# Altium schematic sheet Measurement_CS5463_simple.SchDoc
size A4
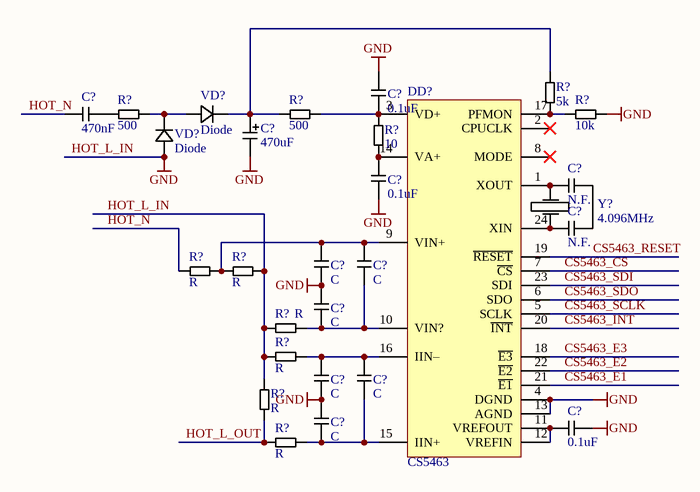
[diagram p0: Measurement_CS5463_simple.SchDoc]

## Parts
(Parts that share a designator on the sheet are numbered #1, #2 ... from top to bottom, then left to right.)
C?#1  0.1uF  [C0603]
C?#2  470nF  [C0603]
C?#3  470uF  [C_EL_6.3]
C?#4  0.1uF  [C0603]
C?#5  N.F.  [C0603]
C?#6  N.F.  [C0603]
C?#7  C  [C0603]
C?#8  C  [C0603]
C?#9  C  [C0603]
C?#10  C  [C0603]
C?#11  C  [C0603]
C?#12  C  [C0603]
C?#13  0.1uF  [C0603]
DD?  CS5463  [TSSOP-24]
R?#1  5k  [R0603]
R?#2  500  [R0603]
R?#3  500  [R0603]
R?#4  10k  [R0603]
R?#5  10  [R0603]
R?#6  R  [R0603]
R?#7  R  [R0603]
R?#8  R  [R0603]
R?#9  R  [R0603]
R?#10  R  [R0805]
R?#11  R  [R0603]
VD?#1  Diode  [SOD-123]
VD?#2  Diode  [SOD-123]
Y?  4.096MHz  [Xtal 0532]

## Nets
HOT_L_IN: C?#1.1 C?#3.2 C?#4.2 C?#7.2 C?#9.1 C?#10.2 C?#12.1 C?#13.2 DD?.4(DGND) DD?.13(AGND) R?#4.2 R?#7.2 R?#8.1 R?#9.1 R?#10.2 VD?#2.1(K)  [also labelled GND]
CS5463_CS: DD?.7(~{CS})
CS5463_E1: DD?.21(~{E1})
CS5463_E2: DD?.22(~{E2})
CS5463_E3: DD?.18(~{E3})
CS5463_INT: DD?.20(~{INT})
CS5463_RESET: DD?.19(~{RESET})
CS5463_SCLK: DD?.5(SCLK)
CS5463_SDI: DD?.23(SDI)
CS5463_SDO: DD?.6(SDO)
HOT_L_OUT: R?#10.1 R?#11.1
HOT_N: C?#2.1 R?#6.1
NetC?#1_2: C?#1.2 DD?.3(VD+) R?#3.2 R?#5.2
NetC?#2_2: C?#2.2 R?#2.1
NetC?#3_1: C?#3.1 R?#1.2 R?#3.1 VD?#1.2(A)
NetC?#4_1: C?#4.1 DD?.14(VA+) R?#5.1
NetC?#5_1: C?#5.1 DD?.1(XOUT) Y?.4(GND)
NetC?#5_2: C?#5.2 Y?.3(X2)
NetC?#6_1: C?#6.1 DD?.24(XIN) Y?.2(GND)
NetC?#6_2: C?#6.2 Y?.1(X1)
NetC?#7_1: C?#7.1 C?#8.1 DD?.9(VIN+) R?#6.2 R?#7.1
NetC?#8_2: C?#8.2 C?#9.2 DD?.10(VIN?) R?#8.2
NetC?#10_1: C?#10.1 C?#11.1 DD?.16(IIN–) R?#9.2
NetC?#11_2: C?#11.2 C?#12.2 DD?.15(IIN+) R?#11.2
NetC?#13_1: C?#13.1 DD?.11(VREFOUT) DD?.12(VREFIN)
NetDD?_17: DD?.17(PFMON) R?#1.1 R?#4.1
NetR?#2_2: R?#2.2 VD?#1.1(K) VD?#2.2(A)

Not connected (* = marked no-connect by the designer): DD? 2(CPUCLK)* 8(MODE)*

## Library data of the parts
C?#1 C?#2 C?#4-C?#13 = C: Capacitor
C?#3 = CP: Capacitor polarized
DD? = CS5463: Power/Energy metering IC
R?#1-R?#11 = R: Resistor
VD?#1 VD?#2 = Diode: SMD diode
Y? = Xtal: Quartz crystal